# EAGLE schematic ESP32 alcohol dispenser schematic (EAGLE 9.6.2)
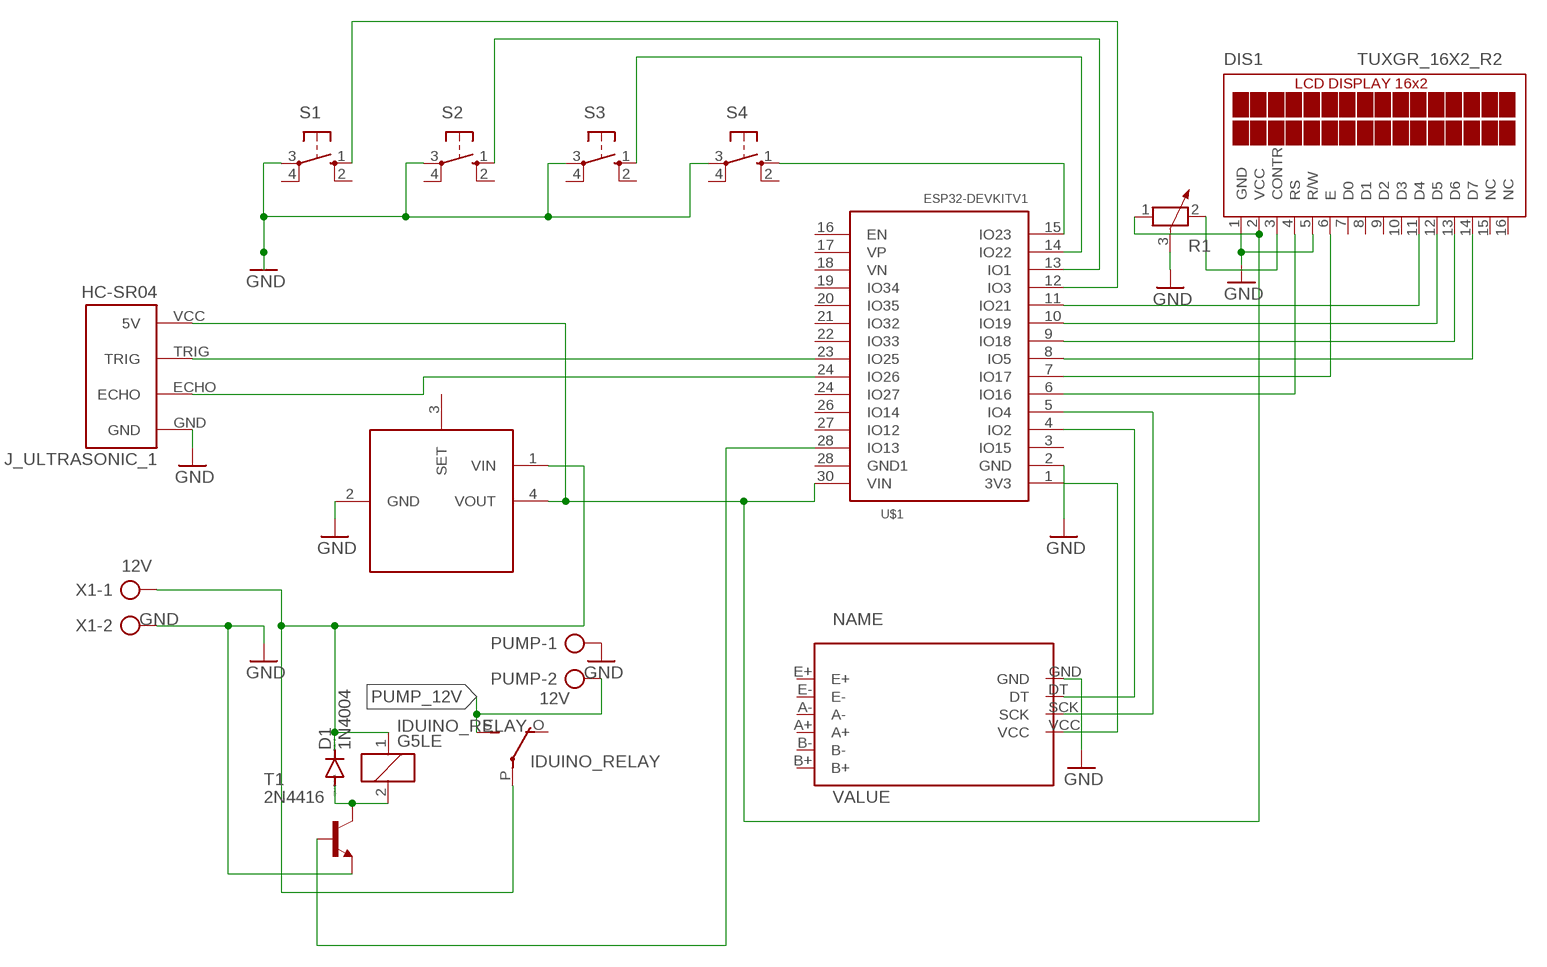
[diagram p0: schematic, sheet 1]

## Parts
D1  1N4004  [DO41-10]
DIS1  TUXGR_16X2_R2  [TUXGR_16X2_R2]
IDUINO_RELAY  G5LE  [G5LE]
J_ULTRASONIC_1  HC-SR04  [HC-SR04_FOOTPRINT]
LM25965  LM2596S_MODULE  [MOLEX-1X4_LOCK]
PUMP  12V  AK500/2-H  [AK500/2-H]
R1  POTENTIOMETER_PT-10  [PT-10]
S1  10-XX  [B3F-10XX]
S2  10-XX  [B3F-10XX]
S3  10-XX  [B3F-10XX]
S4  10-XX  [B3F-10XX]
T1  2N4416  [TO92]
U$1  ESP32DEVKITV1  [ESP32-DEVKITV1]
U$3  HX711A  [HX711]
X1  AK300/2  [AK300/2]

## Nets
GND: DIS1.1(GND) DIS1.5(R/W) J_ULTRASONIC_1.GND LM25965.2(GND) PUMP.1 R1.3 S1.3(P) S2.3(P) S3.3(P) S4.3(P) T1.3(E) U$1.2(GND) U$3.GND X1.2
N$1: DIS1.6(E) U$1.7(IO17)
N$2: T1.2(B) U$1.28(IO13)
N$3: U$1.1(3V3) U$3.VCC
N$4: U$1.4(IO2) U$3.DT
N$5: U$1.5(IO4) U$3.SCK
N$6: J_ULTRASONIC_1.ECHO U$1.24(IO26)
N$7: J_ULTRASONIC_1.TRIG U$1.23(IO25)
N$8: S4.1(S) U$1.15(IO23)
N$9: S3.1(S) U$1.14(IO22)
N$10: S2.1(S) U$1.13(IO1)
N$11: S1.1(S) U$1.12(IO3)
N$12: D1.A IDUINO_RELAY.2 T1.1(C)
N$13: DIS1.11(D4) U$1.11(IO21)
N$14: DIS1.12(D5) U$1.10(IO19)
N$15: DIS1.13(D6) U$1.9(IO18)
N$16: DIS1.14(D7) U$1.8(IO5)
N$17: DIS1.2(VCC) J_ULTRASONIC_1.VCC(5V) LM25965.4(VOUT) R1.1 U$1.30(VIN)
N$18: DIS1.4(RS) U$1.6(IO16)
N$19: D1.C IDUINO_RELAY.1 IDUINO_RELAY.P(2:P) LM25965.1(VIN) X1.1
N$20: DIS1.3(CONTR) R1.2
PUMP_12V: IDUINO_RELAY.S(2:S) PUMP.2
Unconnected: DIS1.7(D0) DIS1.8(D1) DIS1.9(D2) DIS1.10(D3) DIS1.15(NC) DIS1.16(NC) IDUINO_RELAY.O(2:O) LM25965.3(SET) S1.2(S1) S1.4(P1) S2.2(S1) S2.4(P1) S3.2(S1) S3.4(P1) S4.2(S1) S4.4(P1) U$1.3(IO15) U$1.16(EN) U$1.17(VP) U$1.18(VN) U$1.19(IO34) U$1.20(IO35) U$1.21(IO32) U$1.22(IO33) U$1.24(IO27) U$1.26(IO14) U$1.27(IO12) U$1.28(GND1) U$3.A+ U$3.A- U$3.B+ U$3.B- U$3.E+ U$3.E-

## Library data of the parts
D1 = diode:1N4004: DIODE general purpose rectifier, 1 A
DIS1 = display-lcd:TUXGR_16X2_R2: Tuxgraphics LCD display 16x2 characters reflective, without background light Source: tuxgr_12x2_r2.pdf; OC_FARNELL: unknown; OC_NEWARK: unknown
IDUINO_RELAY = relay:G5LE: RELAY 1 x switch, 10 A/120 V AC, 8 A/30 V DC, Omron; OC_FARNELL: unknown; OC_NEWARK: unknown
J_ULTRASONIC_1 = Ultrasonic Sensor HC-SR04:HC-SR04: Ultrasonic Sensor HC-SR04
LM25965 = LM2596S_Module:LM2596S_MODULE
PUMP = con-ptr500:AK500/2-H: CONNECTOR Aug. 2004 / PTR Meßtechnik: Die Bezeichnung der Serie AK505 wurde geändert. Es handelt sich hierbei um AK500 in horizontaler Ausführung.; OC_FARNELL: unknown; OC_NEWARK: unknown
R1 = rcl:POTENTIOMETER_: Potentiometer; SPICEMODEL: POT; SPICEPREFIX: X
S1-S4 = switch-omron:10-XX: OMRON SWITCH; MPN: B3F-1000; OC_FARNELL: 176432; OC_NEWARK: 36M3542
T1 = transistor-neu-to92:2N4416: NPN TRANSISTOR
U$1 = ESP32-DEVKITV1:ESP32DEVKITV1
U$3 = HX711:HX711
X1 = con-ptr500:AK300/2: CONNECTOR; OC_FARNELL: unknown; OC_NEWARK: unknown

## Module POMPA
Ports: 

### Library data of the parts